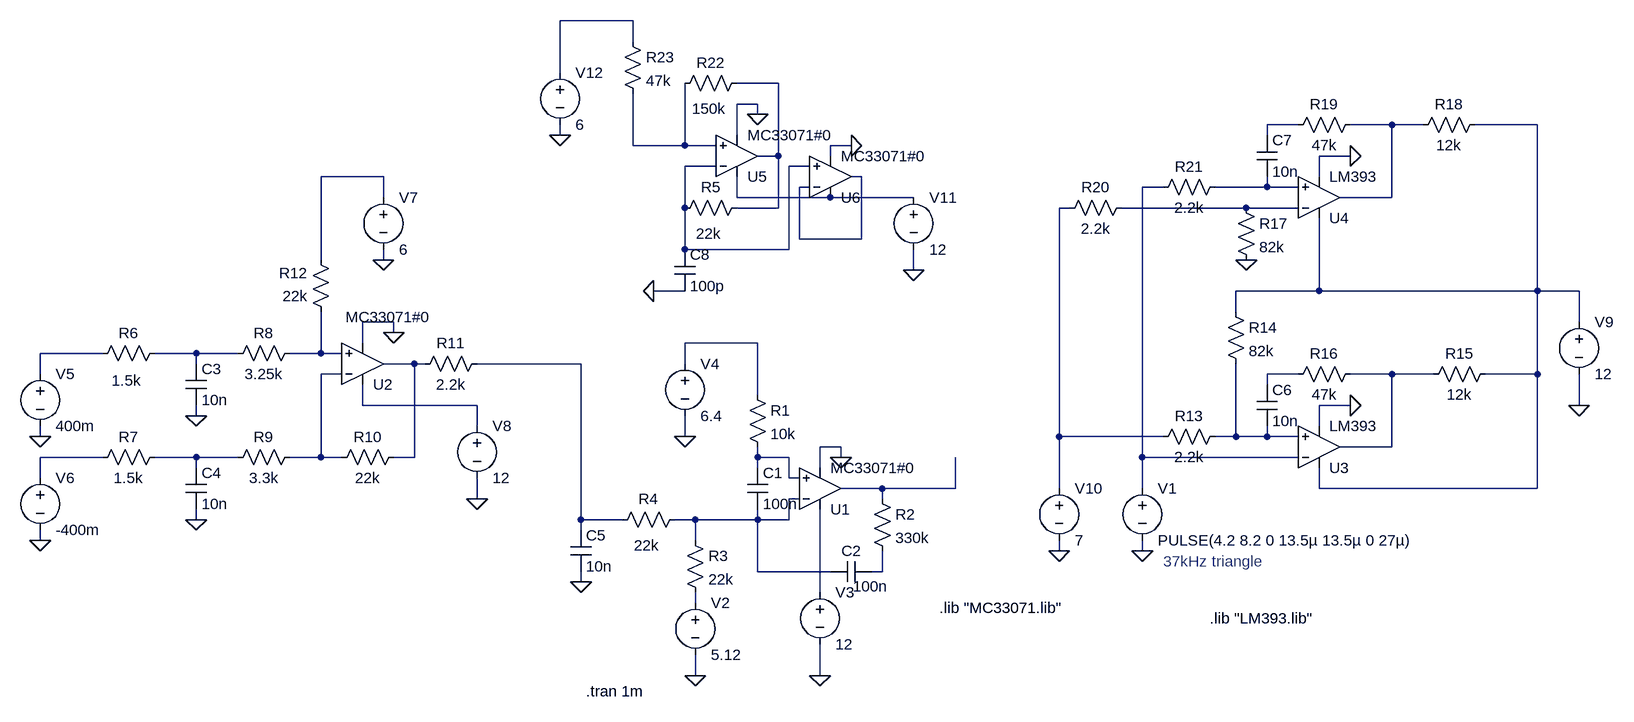
[diagram p0: schematic opamp.asc]
opamp.asc, the LTspice schematic file:
Version 4
SHEET 1 1608 680
WIRE 96 -512 -16 -512
WIRE 96 -480 96 -512
WIRE -16 -432 -16 -512
WIRE 320 -416 256 -416
WIRE 288 -384 256 -384
WIRE 288 -368 288 -384
WIRE 1120 -352 1072 -352
WIRE 1264 -352 1200 -352
WIRE 1312 -352 1264 -352
WIRE 1488 -352 1392 -352
WIRE -16 -336 -16 -352
WIRE 256 -336 256 -384
WIRE 1072 -336 1072 -352
WIRE 96 -320 96 -400
WIRE 176 -320 176 -416
WIRE 176 -320 96 -320
WIRE 224 -320 176 -320
WIRE 432 -320 400 -320
WIRE 320 -304 320 -416
WIRE 320 -304 288 -304
WIRE 400 -304 400 -320
WIRE 1200 -304 1152 -304
WIRE 224 -288 176 -288
WIRE 368 -288 336 -288
WIRE -288 -272 -384 -272
WIRE 448 -272 432 -272
WIRE 1152 -272 1152 -304
WIRE 368 -256 352 -256
WIRE 912 -256 880 -256
WIRE 1072 -256 1072 -272
WIRE 1072 -256 992 -256
WIRE 1120 -256 1072 -256
WIRE -288 -240 -288 -272
WIRE 256 -240 256 -272
WIRE 400 -240 256 -240
WIRE 528 -240 400 -240
WIRE 1264 -240 1264 -352
WIRE 1264 -240 1184 -240
WIRE 176 -224 176 -288
WIRE 320 -224 320 -304
WIRE 320 -224 256 -224
WIRE 768 -224 752 -224
WIRE 1040 -224 848 -224
WIRE 1120 -224 1040 -224
WIRE 352 -176 352 -256
WIRE 448 -176 448 -272
WIRE 448 -176 352 -176
WIRE 176 -160 176 -224
WIRE 336 -160 336 -288
WIRE 336 -160 176 -160
WIRE -384 -144 -384 -272
WIRE -288 -144 -288 -160
WIRE 528 -128 528 -160
WIRE 176 -96 128 -96
WIRE 1152 -96 1152 -208
WIRE 1152 -96 1024 -96
WIRE 1488 -96 1488 -352
WIRE 1488 -96 1152 -96
WIRE 1552 -96 1488 -96
WIRE 1024 -64 1024 -96
WIRE -272 -48 -320 -48
WIRE 1552 -48 1552 -96
WIRE -272 -32 -272 -48
WIRE -320 -16 -320 -48
WIRE 288 -16 176 -16
WIRE -720 0 -816 0
WIRE -576 0 -640 0
WIRE -512 0 -576 0
WIRE -384 0 -384 -64
WIRE -384 0 -432 0
WIRE -352 0 -384 0
WIRE -576 16 -576 0
WIRE -240 16 -288 16
WIRE -224 16 -240 16
WIRE 16 16 -144 16
WIRE 176 16 176 -16
WIRE -816 32 -816 0
WIRE -352 32 -384 32
WIRE 1120 32 1072 32
WIRE 1264 32 1200 32
WIRE 1328 32 1264 32
WIRE 1488 32 1488 -96
WIRE 1488 32 1408 32
WIRE 1072 48 1072 32
WIRE 288 64 288 -16
WIRE -320 80 -320 48
WIRE -144 80 -320 80
WIRE 1200 80 1152 80
WIRE 1552 80 1552 32
WIRE -576 96 -576 80
WIRE -144 112 -144 80
WIRE 1152 112 1152 80
WIRE -816 128 -816 112
WIRE 176 128 176 96
WIRE 752 128 752 -224
WIRE 912 128 752 128
WIRE 1024 128 1024 16
WIRE 1024 128 992 128
WIRE 1072 128 1072 112
WIRE 1072 128 1024 128
WIRE 1120 128 1072 128
WIRE 416 144 384 144
WIRE 1264 144 1264 32
WIRE 1264 144 1184 144
WIRE -720 160 -816 160
WIRE -576 160 -640 160
WIRE -512 160 -576 160
WIRE -384 160 -384 32
WIRE -384 160 -432 160
WIRE -352 160 -384 160
WIRE -240 160 -240 16
WIRE -240 160 -272 160
WIRE 288 160 288 144
WIRE 336 160 288 160
WIRE 416 160 416 144
WIRE 880 160 880 -256
WIRE 1120 160 880 160
WIRE -576 176 -576 160
WIRE 288 176 288 160
WIRE 384 176 384 144
WIRE -816 192 -816 160
WIRE 336 192 336 160
WIRE 352 192 336 192
WIRE 480 208 416 208
WIRE 592 208 592 160
WIRE 592 208 480 208
WIRE 752 208 752 128
WIRE 880 208 880 160
WIRE 1152 208 1152 176
WIRE 1488 208 1488 32
WIRE 1488 208 1152 208
WIRE -144 224 -144 192
WIRE 352 224 336 224
WIRE 480 224 480 208
WIRE -576 256 -576 240
WIRE 16 256 16 16
WIRE 80 256 16 256
WIRE 192 256 160 256
WIRE 288 256 288 240
WIRE 288 256 192 256
WIRE 336 256 336 224
WIRE 336 256 288 256
WIRE 16 272 16 256
WIRE -816 288 -816 272
WIRE 192 288 192 256
WIRE 752 304 752 288
WIRE 880 304 880 288
WIRE 288 336 288 256
WIRE 400 336 288 336
WIRE 480 336 480 304
WIRE 480 336 464 336
WIRE 16 352 16 336
WIRE 384 368 384 240
WIRE 192 384 192 368
WIRE 192 496 192 464
WIRE 384 496 384 448
FLAG 192 496 0
FLAG 384 496 0
FLAG 416 160 0
FLAG 176 128 0
FLAG -576 256 0
FLAG -576 96 0
FLAG -272 -32 0
FLAG -816 128 0
FLAG -816 288 0
FLAG -288 -144 0
FLAG -144 224 0
FLAG 16 352 0
FLAG 880 304 0
FLAG 1200 80 0
FLAG 752 304 0
FLAG 1552 80 0
FLAG 1200 -304 0
FLAG 1040 -144 0
FLAG -16 -336 0
FLAG 128 -96 0
FLAG 288 -368 0
FLAG 528 -128 0
FLAG 432 -320 0
SYMBOL voltage 192 368 R0
SYMATTR InstName V2
SYMATTR Value 5.12
SYMBOL cap 272 176 R0
SYMATTR InstName C1
SYMATTR Value 100n
SYMBOL res 272 48 R0
SYMATTR InstName R1
SYMATTR Value 10k
SYMBOL cap 464 320 R90
WINDOW 0 0 32 VBottom 2
WINDOW 3 23 2 VTop 2
SYMATTR InstName C2
SYMATTR Value 100n
SYMBOL res 464 208 R0
SYMATTR InstName R2
SYMATTR Value 330k
SYMBOL voltage 384 352 R0
SYMATTR InstName V3
SYMATTR Value 12
SYMBOL voltage 176 0 R0
SYMATTR InstName V4
SYMATTR Value 6.4
SYMBOL res 176 272 R0
SYMATTR InstName R3
SYMATTR Value 22k
SYMBOL res 176 240 R90
WINDOW 0 0 56 VBottom 2
WINDOW 3 40 59 VTop 2
SYMATTR InstName R4
SYMATTR Value 22k
SYMBOL OpAmps\\opamp2 384 272 M180
SYMATTR InstName U1
SYMATTR Value MC33071#0
SYMBOL res -624 -16 R90
WINDOW 0 0 56 VBottom 2
WINDOW 3 42 59 VTop 2
SYMATTR InstName R6
SYMATTR Value 1.5k
SYMBOL res -624 144 R90
WINDOW 0 0 56 VBottom 2
WINDOW 3 32 56 VTop 2
SYMATTR InstName R7
SYMATTR Value 1.5k
SYMBOL res -416 -16 R90
WINDOW 0 0 56 VBottom 2
WINDOW 3 32 56 VTop 2
SYMATTR InstName R8
SYMATTR Value 3.25k
SYMBOL res -416 144 R90
WINDOW 0 0 56 VBottom 2
WINDOW 3 32 56 VTop 2
SYMATTR InstName R9
SYMATTR Value 3.3k
SYMBOL res -256 144 R90
WINDOW 0 0 56 VBottom 2
WINDOW 3 32 56 VTop 2
SYMATTR InstName R10
SYMATTR Value 22k
SYMBOL res -128 0 R90
WINDOW 0 0 56 VBottom 2
WINDOW 3 32 56 VTop 2
SYMATTR InstName R11
SYMATTR Value 2.2k
SYMBOL res -368 -48 R180
WINDOW 0 36 76 Left 2
WINDOW 3 36 40 Left 2
SYMATTR InstName R12
SYMATTR Value 22k
SYMBOL OpAmps\\opamp2 -320 80 M180
WINDOW 3 -26 136 Left 2
SYMATTR Value MC33071#0
SYMATTR InstName U2
SYMBOL cap -592 16 R0
SYMATTR InstName C3
SYMATTR Value 10n
SYMBOL cap -592 176 R0
SYMATTR InstName C4
SYMATTR Value 10n
SYMBOL voltage -816 16 R0
WINDOW 123 0 0 Left 0
WINDOW 39 0 0 Left 0
SYMATTR InstName V5
SYMATTR Value 400m
SYMBOL voltage -816 176 R0
SYMATTR InstName V6
SYMATTR Value -400m
SYMBOL voltage -288 -256 R0
WINDOW 123 0 0 Left 0
WINDOW 39 0 0 Left 0
SYMATTR InstName V7
SYMATTR Value 6
SYMBOL voltage -144 96 R0
SYMATTR InstName V8
SYMATTR Value 12
SYMBOL cap 0 272 R0
SYMATTR InstName C5
SYMATTR Value 10n
SYMBOL OpAmps\\opamp2 1152 208 M180
SYMATTR InstName U3
SYMATTR Value LM393
SYMBOL voltage 880 192 R0
WINDOW 123 0 0 Left 0
WINDOW 39 0 0 Left 0
SYMATTR InstName V1
SYMATTR Value PULSE(4.2 8.2 0 13.5µ 13.5µ 0 27µ)
SYMBOL voltage 1552 -64 R0
SYMATTR InstName V9
SYMATTR Value 12
SYMBOL res 1008 112 R90
WINDOW 0 0 56 VBottom 2
WINDOW 3 32 56 VTop 2
SYMATTR InstName R13
SYMATTR Value 2.2k
SYMBOL res 1008 -80 R0
SYMATTR InstName R14
SYMATTR Value 82k
SYMBOL voltage 752 192 R0
WINDOW 123 0 0 Left 0
WINDOW 39 0 0 Left 0
SYMATTR InstName V10
SYMATTR Value 7
SYMBOL res 1424 16 R90
WINDOW 0 0 56 VBottom 2
WINDOW 3 32 56 VTop 2
SYMATTR InstName R15
SYMATTR Value 12k
SYMBOL res 1216 16 R90
WINDOW 0 0 56 VBottom 2
WINDOW 3 32 56 VTop 2
SYMATTR InstName R16
SYMATTR Value 47k
SYMBOL cap 1056 48 R0
SYMATTR InstName C6
SYMATTR Value 10n
SYMBOL res 1024 -240 R0
SYMATTR InstName R17
SYMATTR Value 82k
SYMBOL res 1408 -368 R90
WINDOW 0 0 56 VBottom 2
WINDOW 3 32 56 VTop 2
SYMATTR InstName R18
SYMATTR Value 12k
SYMBOL res 1216 -368 R90
WINDOW 0 0 56 VBottom 2
WINDOW 3 32 56 VTop 2
SYMATTR InstName R19
SYMATTR Value 47k
SYMBOL cap 1056 -336 R0
SYMATTR InstName C7
SYMATTR Value 10n
SYMBOL OpAmps\\opamp2 1152 -176 M180
SYMATTR InstName U4
SYMATTR Value LM393
SYMBOL res 864 -240 R90
WINDOW 0 0 56 VBottom 2
WINDOW 3 32 56 VTop 2
SYMATTR InstName R20
SYMATTR Value 2.2k
SYMBOL res 1008 -272 R90
WINDOW 0 0 56 VBottom 2
WINDOW 3 32 56 VTop 2
SYMATTR InstName R21
SYMATTR Value 2.2k
SYMBOL OpAmps\\opamp2 256 -240 M180
SYMATTR InstName U5
SYMATTR Value MC33071#0
SYMBOL res 272 -240 R90
WINDOW 0 0 56 VBottom 2
WINDOW 3 40 59 VTop 2
SYMATTR InstName R5
SYMATTR Value 22k
SYMBOL voltage 528 -256 R0
SYMATTR InstName V11
SYMATTR Value 12
SYMBOL res 272 -432 R90
WINDOW 0 0 56 VBottom 2
WINDOW 3 40 59 VTop 2
SYMATTR InstName R22
SYMATTR Value 150k
SYMBOL voltage -16 -448 R0
WINDOW 123 0 0 Left 0
WINDOW 39 0 0 Left 0
SYMATTR InstName V12
SYMATTR Value 6
SYMBOL res 80 -496 R0
SYMATTR InstName R23
SYMATTR Value 47k
SYMBOL cap 160 -160 R0
SYMATTR InstName C8
SYMATTR Value 100p
SYMBOL OpAmps\\opamp2 400 -208 M180
SYMATTR InstName U6
SYMATTR Value MC33071#0
TEXT 24 520 Left 2 !.tran 1m
TEXT 568 392 Left 2 !.lib "MC33071.lib"
TEXT 984 408 Left 2 !.lib "LM393.lib"
TEXT 912 320 Left 2 ;37kHz triangle

The netlist it stands for:
* opamp.asc
V2 N033 0 5.12
C1 N028 N030 100n
R1 N015 N028 10k
C2 N031 N030 100n
R2 N029 N031 330k
V3 N032 0 12
V4 N015 0 6.4
R3 N030 N033 22k
R4 N030 N020 22k
XU1 N028 N030 N032 0 N029 MC33071#0  ; pins In+ In- V+ V- OUT
R6 N017 N016 1.5k
R7 N027 N026 1.5k
R8 N018 N017 3.25k
R9 N021 N027 3.3k
R10 N019 N021 22k
R11 N020 N019 2.2k
R12 N018 N008 22k
XU2 N018 N021 N024 0 N019 MC33071#0  ; pins In+ In- V+ V- OUT
C3 N017 0 10n
C4 N027 0 10n
V5 N016 0 400m
V6 N026 0 -400m
V7 N008 0 6
V8 N024 0 12
C5 N020 0 10n
XU3 N025 N010 N005 0 N023 LM393  ; pins In+ In- V+ V- OUT
V1 N010 0 PULSE(4.2 8.2 0 13.5µ 13.5µ 0 27µ)
V9 N005 0 12
R13 N025 N013 2.2k
R14 N005 N025 82k
V10 N013 0 7
R15 N005 N023 12k
R16 N023 N022 47k
C6 N022 N025 10n
R17 N014 0 82k
R18 N005 N004 12k
R19 N004 N003 47k
C7 N003 N011 10n
XU4 N011 N014 N005 0 N004 LM393  ; pins In+ In- V+ V- OUT
R20 N014 N013 2.2k
R21 N011 N010 2.2k
XU5 N006 N007 N012 0 N002 MC33071#0  ; pins In+ In- V+ V- OUT
R5 N002 N007 22k
V11 N012 0 12
R22 N002 N006 150k
V12 N001 0 6
R23 N001 N006 47k
C8 N007 0 100p
XU6 N007 N009 N012 0 N009 MC33071#0  ; pins In+ In- V+ V- OUT
.tran 1m
.lib "MC33071.lib"
.lib "LM393.lib"
* 37kHz triangle
.backanno
.end